# Altium project ARM2toARM6Adapter.PrjPcb
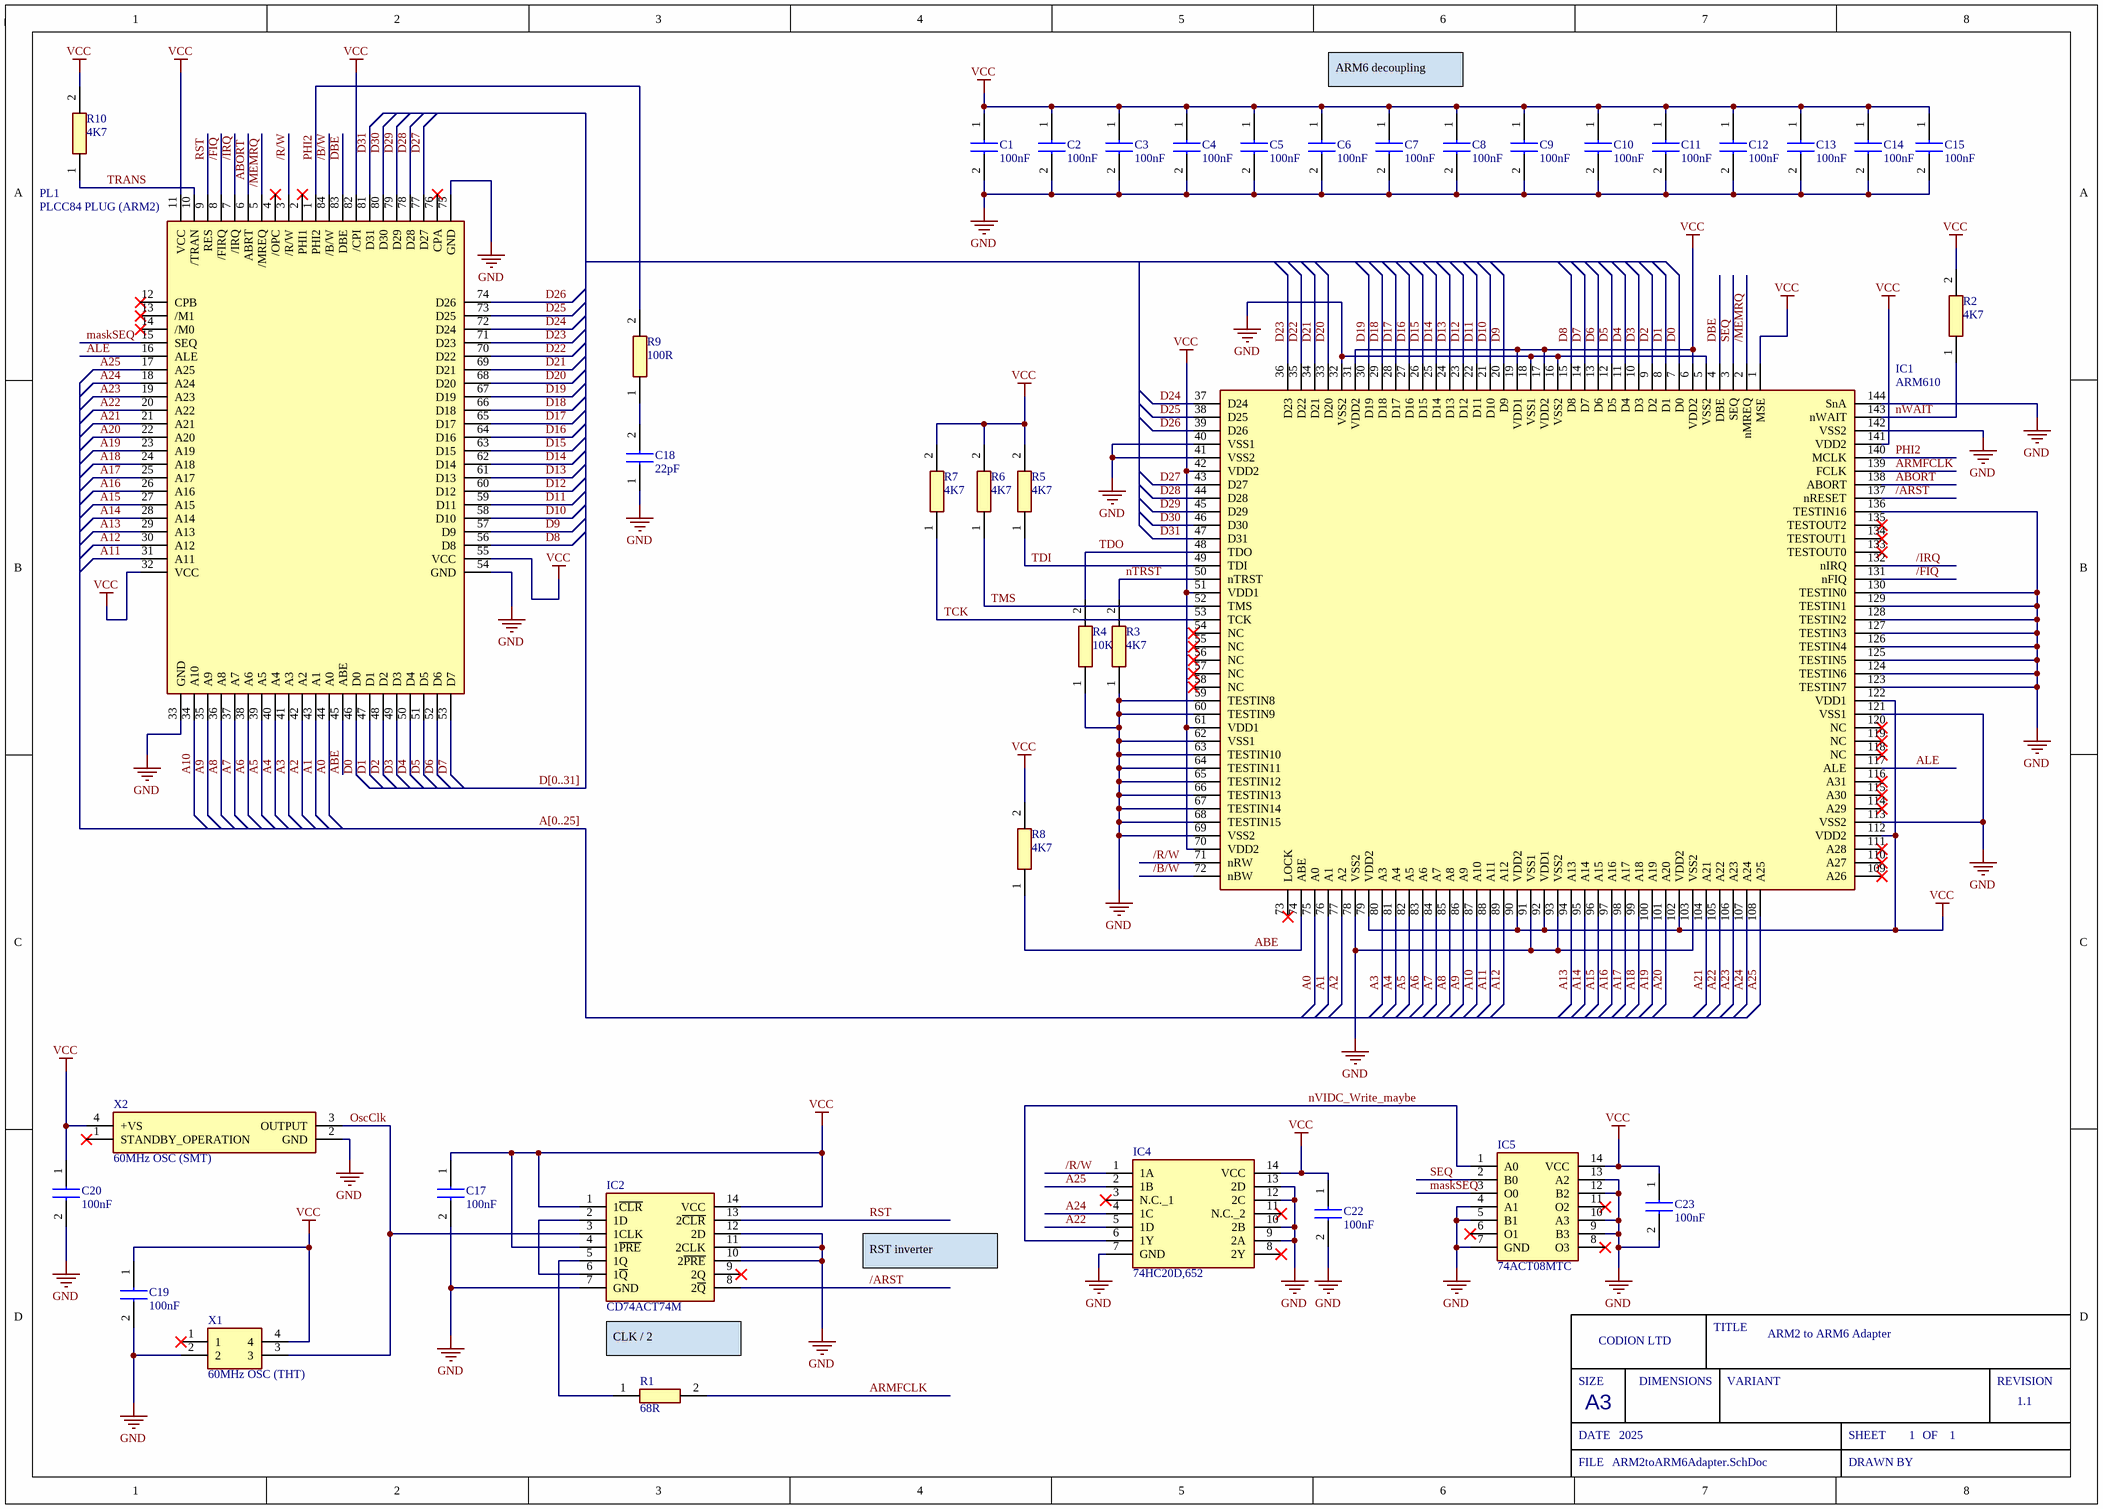
[diagram p0: ARM2toARM6Adapter.SchDoc]
BOM_RevNo: 1.1; Engineer_Name: Codion Ltd; PCB_RevNo: 1.1; Project_Title: ARM2 to ARM6 Adapter; ProjectName: ARM2 to ARM6 Adapter; Sch_releaseDate: 2025; Sch_RevNo: 1.1
1 sheet, 38 parts. Net scope: global (net labels, ports and power ports of the same name join across sheets).
Board file: ARM2toARM6Adapter.pcbdoc

## Sheet ARM2toARM6Adapter.SchDoc: ARM2 to ARM3 Adapter
size A3; DocumentNumber: 1; SheetNumber: 1; SheetTotal: 1

### Parts
C1  100nF  [CAPC2012X145N]
C2  100nF  [CAPC2012X145N]
C3  100nF  [CAPC2012X145N]
C4  100nF  [CAPC2012X145N]
C5  100nF  [CAPC2012X145N]
C6  100nF  [CAPC2012X145N]
C7  100nF  [CAPC2012X145N]
C8  100nF  [CAPC2012X145N]
C9  100nF  [CAPC2012X145N]
C10  100nF  [CAPC2012X145N]
C11  100nF  [CAPC2012X145N]
C12  100nF  [CAPC2012X145N]
C13  100nF  [CAPC2012X145N]
C14  100nF  [CAPC2012X145N]
C15  100nF  [CAPC2012X145N]
C17  100nF  [CAPC2012X145N]
C18  22pF  [CAPC1608X90N]
C19  100nF  [CAPC2012X145N]
C20  100nF  [CAPC2012X145N]
C22  100nF  [CAPC2012X145N]
C23  100nF  [CAPC2012X145N]
IC1  ARM610  [TQFP144]
IC2  CD74ACT74M  [SOIC127P600X175-14N]
IC4  74HC20D,652  [SOIC127P600X175-14N]
IC5  74ACT08MTC  [SOIC127P600X175-14N]
PL1  PLCC84 PLUG (ARM2)  [PLCC84_PLUG]
R1  value 68R  [RESC2012X50N]  (hidden comment: CRCW080568R0FKEA)
R2  4K7  [RESC1005X35N]
R3  4K7  [RESC1005X35N]
R4  10K  [RESC1005X35N]
R5  4K7  [RESC1005X35N]
R6  4K7  [RESC1005X35N]
R7  4K7  [RESC1005X35N]
R8  4K7  [RESC1005X35N]
R9  100R  [RESC2012X60N]
R10  4K7  [RESC1005X35N]
X1  60MHz OSC (THT)  [DIPS762W56P1524L1778H241Q4N]
X2  60MHz OSC (SMT)  [LFSPXO018035Bulk]

### Nets
GND: C1.2 C2.2 C3.2 C4.2 C5.2 C6.2 C7.2 C8.2 C9.2 C10.2 C11.2 C12.2 C13.2 C14.2 C15.2 C17.2 C18.1 C19.2 C20.2 C22.2 C23.2 IC1.5(VSS2) IC1.16(VSS2) IC1.18(VSS1) IC1.32(VSS2) IC1.40(VSS1) IC1.41(VSS2) IC1.59(TESTIN8) IC1.60(TESTIN9) IC1.62(VSS1) IC1.63(TESTIN10) IC1.64(TESTIN11) IC1.65(TESTIN12) IC1.66(TESTIN13) IC1.67(TESTIN14) IC1.68(TESTIN15) IC1.69(VSS2) IC1.78(VSS2) IC1.91(VSS1) IC1.93(VSS2) IC1.103(VSS2) IC1.113(VSS2) IC1.121(VSS1) IC1.123(TESTIN7) IC1.124(TESTIN6) IC1.125(TESTIN5) IC1.126(TESTIN4) IC1.127(TESTIN3) IC1.128(TESTIN2) IC1.129(TESTIN1) IC1.130(TESTIN0) IC1.136(TESTIN16) IC1.142(VSS2) IC1.144(SnA) IC2.7(GND) IC2.10(2~{PRE}) IC2.11(2CLK) IC2.12(2D) IC4.7(GND) IC4.9(2A) IC4.10(2B) IC4.12(2C) IC4.13(2D) IC5.4(A1) IC5.5(B1) IC5.7(GND) IC5.9(B3) IC5.10(A3) IC5.12(B2) IC5.13(A2) PL1.33(GND) PL1.54(GND) PL1.75(GND) R3.1 R4.1 X1.2 X2.2(GND)
VCC: C1.1 C2.1 C3.1 C4.1 C5.1 C6.1 C7.1 C8.1 C9.1 C10.1 C11.1 C12.1 C13.1 C14.1 C15.1 C17.1 C19.1 C20.1 C22.1 C23.1 IC1.1(MSE) IC1.6(VDD2) IC1.17(VDD2) IC1.19(VDD1) IC1.31(VDD2) IC1.42(VDD2) IC1.51(VDD1) IC1.61(VDD1) IC1.70(VDD2) IC1.79(VDD2) IC1.90(VDD2) IC1.92(VDD1) IC1.102(VDD2) IC1.112(VDD2) IC1.122(VDD1) IC1.141(VDD2) IC2.1(1~{CLR}) IC2.4(1~{PRE}) IC2.14(VCC) IC4.14(VCC) IC5.14(VCC) PL1.11(VCC) PL1.32(VCC) PL1.55(VCC) PL1.82(/CPI) R2.2 R5.2 R6.2 R7.2 R8.2 R10.2 X1.4 X2.4(+VS)
/ARST: IC1.137(nRESET) IC2.8(2~{Q})
/B/W: IC1.72(nBW) PL1.84(/B/W)
/FIQ: IC1.131(nFIQ) PL1.8(/FIRQ)
/IRQ: IC1.132(nIRQ) PL1.7(/IRQ)
/MEMRQ: IC1.2(nMREQ) PL1.5(/MREQ)
/R/W: IC1.71(nRW) IC4.1(1A) PL1.3(/R/W)
A0: IC1.75(A0) PL1.44(A0)
A1: IC1.76(A1) PL1.43(A1)
A2: IC1.77(A2) PL1.42(A2)
A3: IC1.80(A3) PL1.41(A3)
A4: IC1.81(A4) PL1.40(A4)
A5: IC1.82(A5) PL1.39(A5)
A6: IC1.83(A6) PL1.38(A6)
A7: IC1.84(A7) PL1.37(A7)
A8: IC1.85(A8) PL1.36(A8)
A9: IC1.86(A9) PL1.35(A9)
A10: IC1.87(A10) PL1.34(A10)
A11: IC1.88(A11) PL1.31(A11)
A12: IC1.89(A12) PL1.30(A12)
A13: IC1.94(A13) PL1.29(A13)
A14: IC1.95(A14) PL1.28(A14)
A15: IC1.96(A15) PL1.27(A15)
A16: IC1.97(A16) PL1.26(A16)
A17: IC1.98(A17) PL1.25(A17)
A18: IC1.99(A18) PL1.24(A18)
A19: IC1.100(A19) PL1.23(A19)
A20: IC1.101(A20) PL1.22(A20)
A21: IC1.104(A21) PL1.21(A21)
A22: IC1.105(A22) IC4.5(1D) PL1.20(A22)
A23: IC1.106(A23) PL1.19(A23)
A24: IC1.107(A24) IC4.4(1C) PL1.18(A24)
A25: IC1.108(A25) IC4.2(1B) PL1.17(A25)
ABE: IC1.74(ABE) PL1.45(ABE) R8.1
ABORT: IC1.138(ABORT) PL1.6(ABRT)
ALE: IC1.117(ALE) PL1.16(ALE)
ARMFCLK: IC1.139(FCLK) R1.2
D0: IC1.7(D0) PL1.46(D0)
D1: IC1.8(D1) PL1.47(D1)
D2: IC1.9(D2) PL1.48(D2)
D3: IC1.10(D3) PL1.49(D3)
D4: IC1.11(D4) PL1.50(D4)
D5: IC1.12(D5) PL1.51(D5)
D6: IC1.13(D6) PL1.52(D6)
D7: IC1.14(D7) PL1.53(D7)
D8: IC1.15(D8) PL1.56(D8)
D9: IC1.20(D9) PL1.57(D9)
D10: IC1.21(D10) PL1.58(D10)
D11: IC1.22(D11) PL1.59(D11)
D12: IC1.23(D12) PL1.60(D12)
D13: IC1.24(D13) PL1.61(D13)
D14: IC1.25(D14) PL1.62(D14)
D15: IC1.26(D15) PL1.63(D15)
D16: IC1.27(D16) PL1.64(D16)
D17: IC1.28(D17) PL1.65(D17)
D18: IC1.29(D18) PL1.66(D18)
D19: IC1.30(D19) PL1.67(D19)
D20: IC1.33(D20) PL1.68(D20)
D21: IC1.34(D21) PL1.69(D21)
D22: IC1.35(D22) PL1.70(D22)
D23: IC1.36(D23) PL1.71(D23)
D24: IC1.37(D24) PL1.72(D24)
D25: IC1.38(D25) PL1.73(D25)
D26: IC1.39(D26) PL1.74(D26)
D27: IC1.43(D27) PL1.77(D27)
D28: IC1.44(D28) PL1.78(D28)
D29: IC1.45(D29) PL1.79(D29)
D30: IC1.46(D30) PL1.80(D30)
D31: IC1.47(D31) PL1.81(D31)
DBE: IC1.4(DBE) PL1.83(DBE)
maskSEQ: IC5.3(O0) PL1.15(SEQ)
nTRST: IC1.50(nTRST) R3.2
nVIDC_Write_maybe: IC4.6(1Y) IC5.1(A0)
nWAIT: IC1.143(nWAIT) R2.1
OscClk: IC2.3(1CLK) X1.3 X2.3(OUTPUT)
PHI2: IC1.140(MCLK) PL1.1(PHI2) R9.2
RST: IC2.13(2~{CLR}) PL1.9(RES)
SEQ: IC1.3(SEQ) IC5.2(B0)
TCK: IC1.53(TCK) R7.1
TDI: IC1.49(TDI) R5.1
TDO: IC1.48(TDO) R4.2
TMS: IC1.52(TMS) R6.1
TRANS: PL1.10(/TRAN) R10.1
NetC18_2: C18.2 R9.1
NetIC2_2: IC2.2(1D) IC2.6(1~{Q})
NetIC2_5: IC2.5(1Q) R1.1

Not connected (* = marked no-connect by the designer): IC1 54(NC)* 55(NC)* 56(NC)* 57(NC)* 58(NC)* 73(LOCK)* 109(A26)* 110(A27)* 111(A28)* 114(A29)* 115(A30)* 116(A31)* 118(NC)* 119(NC)* 120(NC)* 133(TESTOUT0)* 134(TESTOUT1)* 135(TESTOUT2)*; IC2 9(2Q)*; IC4 3(N.C._1)* 8(2Y)* 11(N.C._2)*; IC5 6(O1)* 8(O3)* 11(O2)*; PL1 2(PHI1)* 4(/OPC)* 12(CPB)* 13(/M1)* 14(/M0)* 76(CPA)*; X1 1*; X2 1(STANDBY_OPERATION)*

### Buses and harness runs
bus A[0..25]
bus D[0..31]

### Notes on the sheet
- ARM6 decoupling
- RST inverter
- CLK / 2
- SIZE
- CODION LTD
- DIMENSIONS
- TITLE
- VARIANT
- REVISION
- DATE
- A3
- SHEET
- OF
- FILE
- DRAWN BY

### Library data of the parts
C1-C15 C17 C19 C20 C22 C23 = C2012X7R1H104K125AM: Capacitor; Manufacturer_Name: TDK; Datasheet Link: https://product.tdk.com/info/en/catalog/datasheets/mlcc_commercial_midvoltage_en.pdf; Height: 1.45mm; Manufacturer_Part_Number: C2012X7R1H104K125AM; Mouser Part Number: 810-C2012X7R1H104KT5; Mouser Price/Stock: https://www.mouser.com/Search/Refine.aspx?Keyword=810-C2012X7R1H104KT5; Arrow Part Number: C2012X7R1H104K125AM; Arrow Price/Stock: https://www.arrow.com/en/products/c2012x7r1h104k125am/tdk
C18 = CGA3E2NP02A220J080AA: Capacitor; Manufacturer_Name: TDK; Datasheet Link: http://docs-europe.electrocomponents.com/webdocs/14e9/0900766b814e9125.pdf; Height: 0.9mm; Manufacturer_Part_Number: CGA3E2NP02A220J080AA; Mouser Part Number: 810-CGA3E2NP02A220JA
IC1 = VY86C610: Manufacturer_Name: VLSI; Manufacturer_Part_Number: VY86C610C; Height: 1.6mm
IC2 = CD74ACT74M: Integrated Circuit; Manufacturer_Name: Texas Instruments; Datasheet Link: http://www.ti.com/lit/ds/symlink/cd74act74.pdf; Height: 1.75mm; Manufacturer_Part_Number: CD74ACT74M; Mouser Part Number: 595-CD74ACT74M; Mouser Price/Stock: https://www.mouser.com/Search/Refine.aspx?Keyword=595-CD74ACT74M
IC4 = 74HC20D,652: Integrated Circuit; Manufacturer_Name: Nexperia; Datasheet Link: https://assets.nexperia.com/documents/data-sheet/74HC20.pdf; Height: 1.75mm; Manufacturer_Part_Number: 74HC20D,652; Mouser Part Number: 771-74HC20D; Mouser Price/Stock: https://www.mouser.co.uk/ProductDetail/Nexperia/74HC20D652?qs=P62ublwmbi%252BDockmVLpVUA%3D%3D; Arrow Part Number: 74HC20D,652; Arrow Price/Stock: https://www.arrow.com/en/products/74hc20d652/nexperia?utm_currency=USD&region=nac
IC5 = 74ACT08MTC: Integrated Circuit; Manufacturer_Name: onsemi; Datasheet Link: https://www.onsemi.com/pdf/datasheet/74act08-d.pdf; Height: 1.75mm; Manufacturer_Part_Number: 74ACT08MTC; Mouser Part Number: 512-74ACT08MTC; Mouser Price/Stock: https://www.mouser.co.uk/ProductDetail/onsemi-Fairchild/74ACT08MTC?qs=XVly9zr84oLwIH6jjYyBlA%3D%3D; Arrow Part Number: 74ACT08MTC; Arrow Price/Stock: https://www.arrow.com/en/products/74act08mtc/on-semiconductor?region=europe
PL1 = PLCC84_PLUG_ARM2: PLCC84 Plug; Manufacturer_Name: Winslow; Manufacturer_Part_Number: W9328; Height: 15mm
R1 = CRCW080568R0FKEA: 68R Resistor; Manufacturer_Name: Vishay; Datasheet Link: http://www.vishay.com/docs/20035/dcrcwe3.pdf; Height: 0.5mm; Manufacturer_Part_Number: CRCW080568R0FKEA; Mouser Part Number: 71-CRCW080568R0FKEA; Mouser Price/Stock: https://www.mouser.com/Search/Refine.aspx?Keyword=71-CRCW080568R0FKEA; Arrow Part Number: CRCW080568R0FKEA; Arrow Price/Stock: https://www.arrow.com/en/products/crcw080568r0fkea/vishay
R2 R3 R5-R8 R10 = CPF0402B4K75E1: Resistor; Manufacturer_Name: TE Connectivity; Datasheet Link: http://www.farnell.com/datasheets/1786775.pdf; Height: 0.35mm; Manufacturer_Part_Number: CPF0402B4K75E1; Mouser Part Number: 279-CPF0402B4K75E1; Mouser Price/Stock: https://www.mouser.co.uk/ProductDetail/TE-Connectivity-Holsworthy/CPF0402B4K75E1?qs=n4i9pByFsMQxVicXLOMgxw%3D%3D; Arrow Part Number: CPF0402B4K75E1; Arrow Price/Stock: https://www.arrow.com/en/products/cpf0402b4k75e1/te-connectivity
R4 = CPF0402B10K5E: Resistor; Manufacturer_Name: TE Connectivity; Datasheet Link: http://www.farnell.com/datasheets/1786775.pdf; Height: 0.35mm; Manufacturer_Part_Number: CPF0402B10K5E; Mouser Part Number: N/A; Mouser Price/Stock: https://www.mouser.co.uk/ProductDetail/TE-Connectivity-Neohm/CPF0402B10K5E?qs=chTDxNqvsymW8ByynyC5nA%3D%3D; Arrow Part Number: CPF0402B10K5E; Arrow Price/Stock: https://www.arrow.com/en/products/cpf0402b10k5e/te-connectivity?region=nac
R9 = CRCW0805100RFKEAC: Resistor; Manufacturer_Name: Vishay; Datasheet Link: https://componentsearchengine.com/Datasheets/1/CRCW0805100RFKEAC.pdf; Height: 0.6mm; Manufacturer_Part_Number: CRCW0805100RFKEAC; Mouser Part Number: 71-CRCW0805100RFKEAC; Mouser Price/Stock: https://www.mouser.co.uk/ProductDetail/Vishay-Dale/CRCW0805100RFKEAC?qs=E3Y5ESvWgWM6LN%2Fsc41QGg%3D%3D; Arrow Part Number: CRCW0805100RFKEAC; Arrow Price/Stock: https://www.arrow.com/en/products/crcw0805100rfkeac/vishay?region=nac
X1 = 1107741: 60MHz OSC; Manufacturer_Name: ARIES; Datasheet Link: http://docs-emea.rs-online.com/webdocs/13f3/0900766b813f3237.pdf; Height: 2.41mm; Manufacturer_Part_Number: 1107741; Mouser Part Number: 535-1107741; Mouser Price/Stock: https://www.mouser.co.uk/ProductDetail/Aries-Electronics/1107741?qs=WZRMhwwaLl%2FApwqojhfzdA%3D%3D
X2 = LFSPXO018035Bulk: Crystal or Oscillator; Manufacturer_Name: IQD; Datasheet Link: https://www.iqdfrequencyproducts.com/products/pn/LFSPXO018035Bulk.pdf; Height: 1.4mm; Manufacturer_Part_Number: LFSPXO018035Bulk; Mouser Part Number: 449-LFSPXO018035BULK; Mouser Price/Stock: https://www.mouser.com/Search/Refine.aspx?Keyword=449-LFSPXO018035BULK